# EAGLE design bluz_remote_v1 (EAGLE 7.3.0)
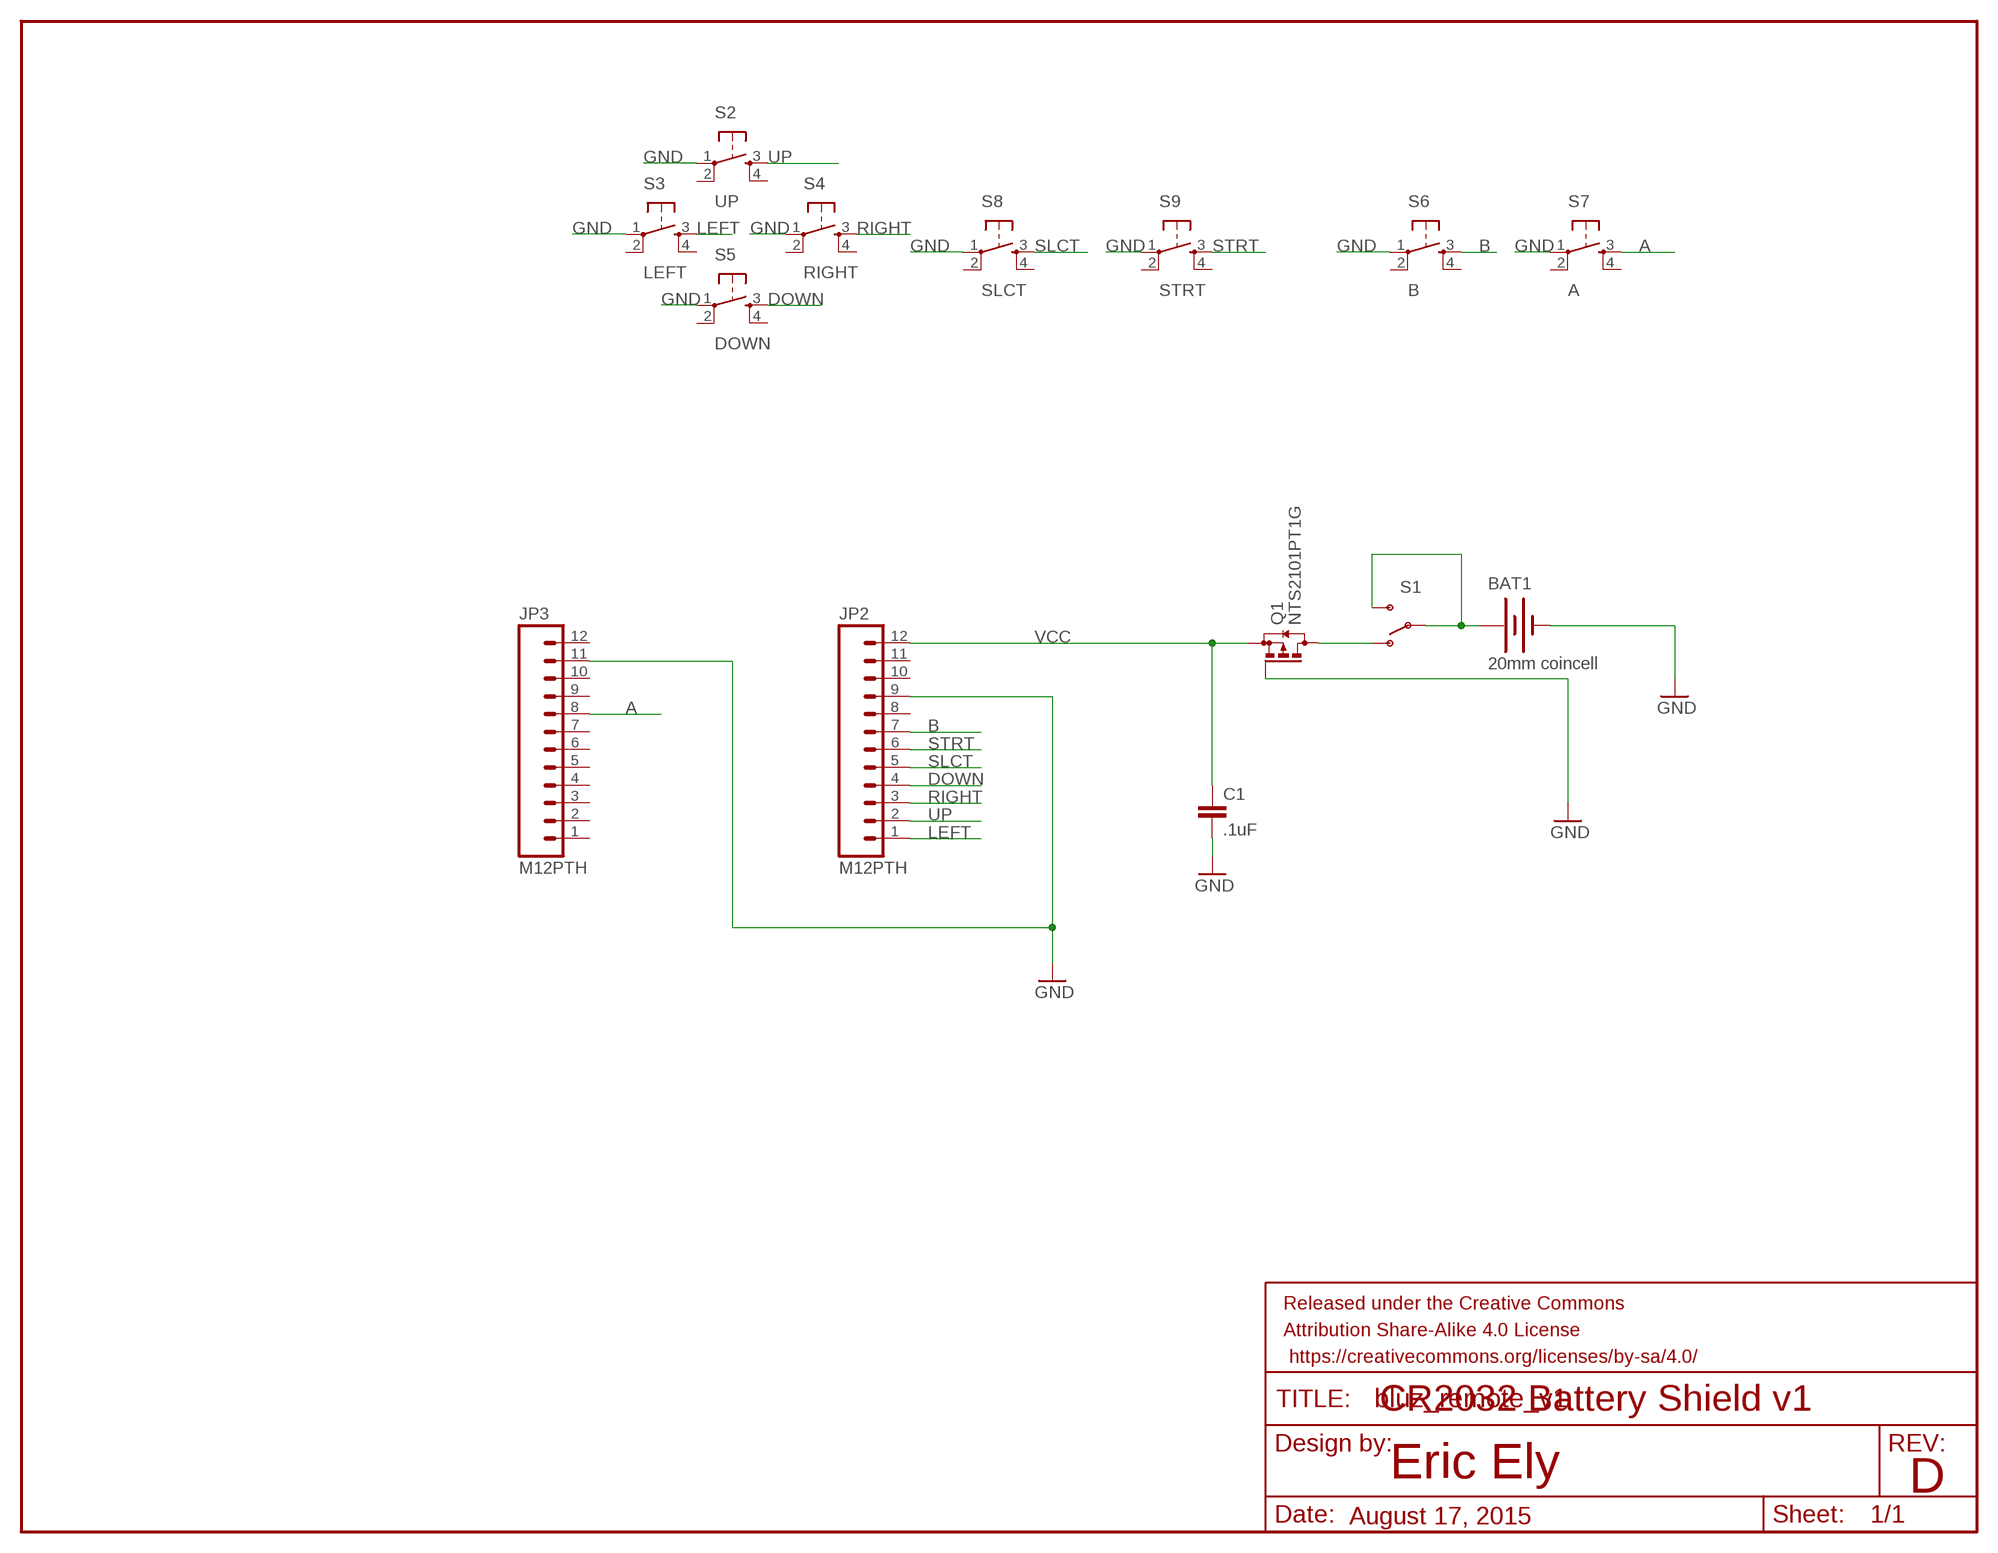
[diagram p0: schematic, sheet 1]

## Parts
BAT1  20mm coincell  BATTERY20MM_4LEGS  [BATTCON_20MM_4LEGS]
C1  .1uF  CAP0603-CAP  [0603-CAP]
FRAME1  FRAME-LETTER  [CREATIVE_COMMONS]
JP2  M12PTH  [1X12]
JP3  M12PTH  [1X12]
Q1  NTS2101PT1G  [SOT323]
S1  SWITCH-SPDTKIT  [SWITCH-SPDT_KIT]
S2  UP  TAC_SWITCHSMD  [TACTILE_SWITCH_SMD]
S3  LEFT  TAC_SWITCHSMD  [TACTILE_SWITCH_SMD]
S4  RIGHT  TAC_SWITCHSMD  [TACTILE_SWITCH_SMD]
S5  DOWN  TAC_SWITCHSMD  [TACTILE_SWITCH_SMD]
S6  B  TAC_SWITCHSMD  [TACTILE_SWITCH_SMD]
S7  A  TAC_SWITCHSMD  [TACTILE_SWITCH_SMD]
S8  SLCT  TAC_SWITCHSMD  [TACTILE_SWITCH_SMD]
S9  STRT  TAC_SWITCHSMD  [TACTILE_SWITCH_SMD]

## Nets
A: JP3.8 S7.3
B: JP2.7 S6.3
DOWN: JP2.4 S5.3
GND: BAT1.2(-) C1.2 JP2.9 JP3.11 Q1.1(G) S2.1 S3.1 S4.1 S5.1 S6.1 S7.1 S8.1 S9.1
LEFT: JP2.1 S3.3
N$1: BAT1.1(+) S1.2(P) S1.3(S)
N$5: Q1.3(D) S1.1(O)
RIGHT: JP2.3 S4.3
SLCT: JP2.5 S8.3
STRT: JP2.6 S9.3
UP: JP2.2 S2.3
VCC: C1.1 JP2.12 Q1.2(S)
Unconnected: JP2.8 JP2.10 JP2.11 JP3.1 JP3.2 JP3.3 JP3.4 JP3.5 JP3.6 JP3.7 JP3.9 JP3.10 JP3.12 S2.2 S2.4 S3.2 S3.4 S4.2 S4.4 S5.2 S5.4 S6.2 S6.4 S7.2 S7.4 S8.2 S8.4 S9.2 S9.4

## Notes on the sheet
- CR2032 Battery Shield v1
- Eric Ely
- D
- August 17, 2015

## Library data of the parts
BAT1 = SparkFun-Electromechanical:BATTERY: Battery Holders Various common sizes : AA, AAA, 20mm coin cell and 12mm coin cell. 20MM_4LEGS, BATT-10373; PROD_ID: BATT-10373
C1 = SparkFun-Capacitors:CAP: Capacitor Standard 0603 ceramic capacitor, and 0.1" leaded capacitor.
FRAME1 = SparkFun-Aesthetics:FRAME-LETTER: Schematic Frame Standard 8.5x11 US Letter frame
JP2 JP3 = SparkFun-Connectors:M12: Header 12 Standard 12-pin 0.1" header. Use with straight break away headers (SKU : PRT-00116), right angle break away headers (PRT-00553), swiss pins (PRT-00743), machine pins (PRT-00117), and female headers (PRT-00115).
Q1 = bluze_libr:NTS2101PT1G
S1 = SparkFun-Electromechanical:SWITCH-SPDT: SPDT Switch Simple slide switch, Spark Fun Electronics SKU : COM-00102 DPDT SMT slide switch, AYZ0202, SWCH-08179; PROD_ID: SWCH-08261
S2-S9 = SparkFun-Electromechanical:TAC_SWITCH: Momentary Switch Button commonly used for reset or general input. Spark Fun Electronics SKU : COM-00097 SMT- SWCH-08247; PROD_ID: SWCH-08247

## Board
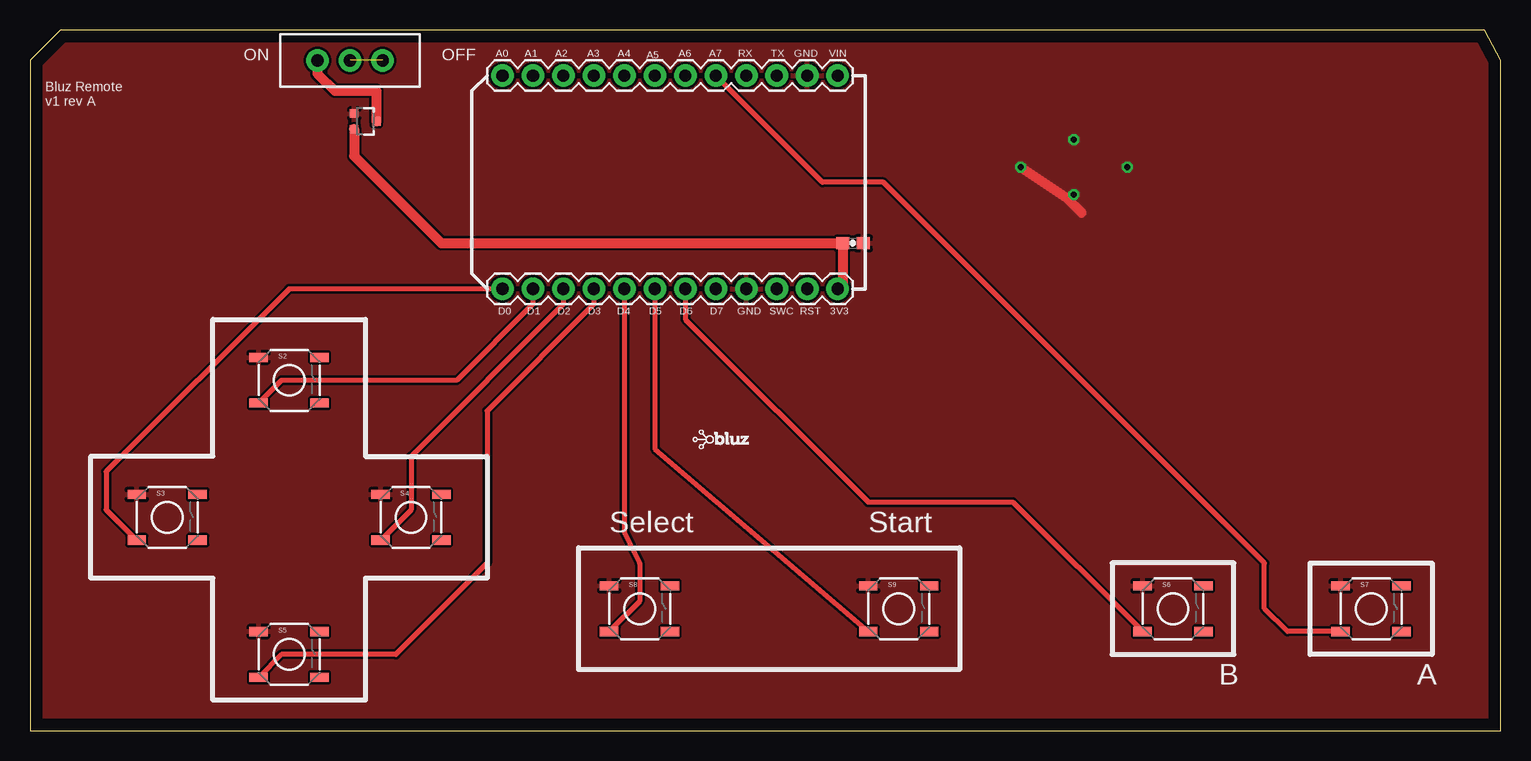
[diagram p1: board, top side]
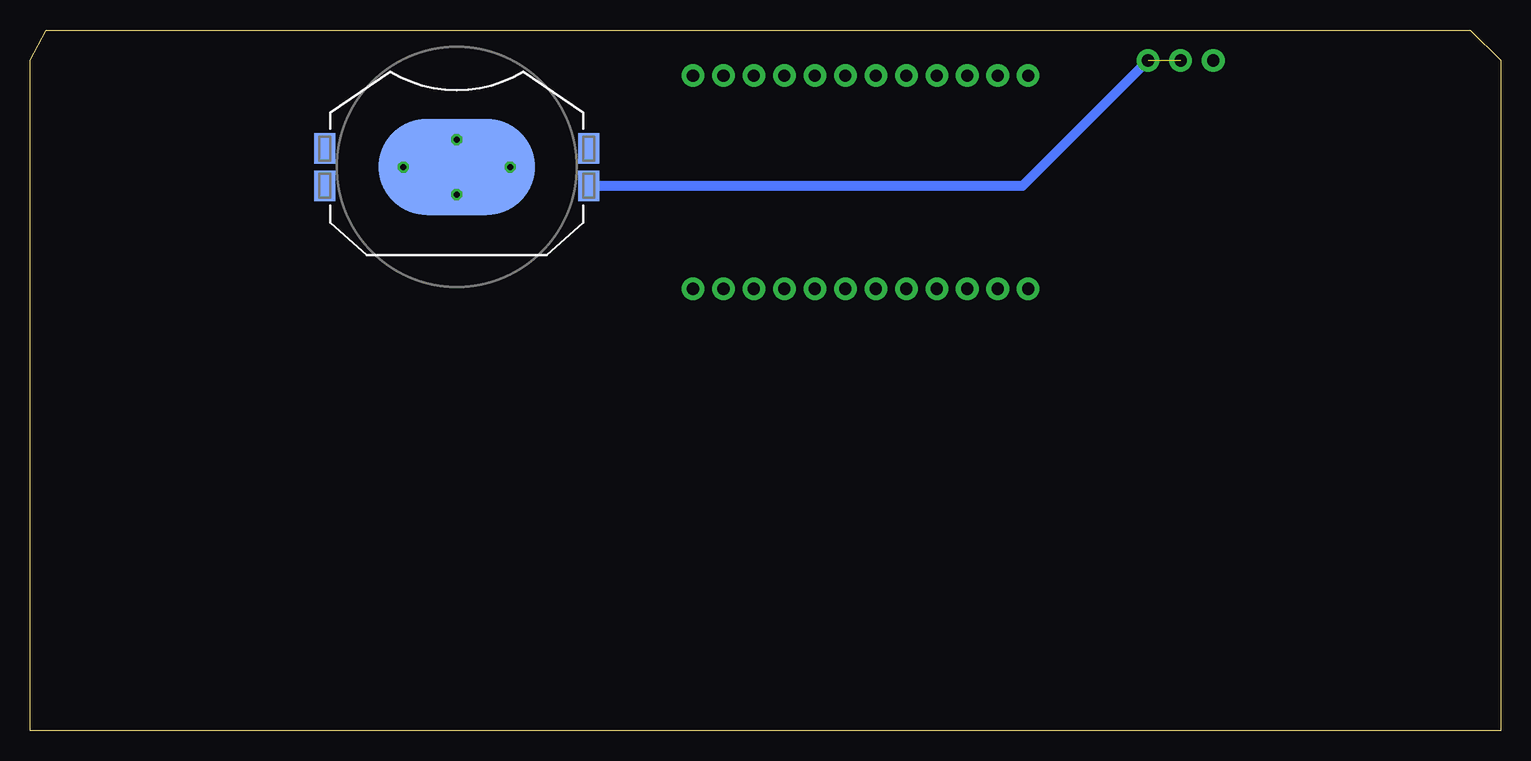
[diagram p2: board, bottom side, seen from below]

Size 122.56 x 58.42 mm. Coordinates in mm from the lower left corner, seen from the top.
Outline: 0,0 122.56,0 122.56,55.88 121.22,58.42 2.54,58.42 0,55.88 0,0
Copper layers (1*16): Top 0.035mm / dielectric 1.5mm / Bottom 0.035mm
Design rules "default *": minimum track width 10mil, minimum drill 24mil, track to track 8mil, track to pad 8mil, pad to pad 8mil, via to via 8mil, smd to smd 8mil, copper to edge 40mil, drill to drill 8mil, minimum pad ring 10mil, minimum via ring 8mil, stop-mask expansion 4mil, vias tented up to drill 31mil, thermal gap 10mil

### Footprints (pad centres in the part's own frame; a part is rotated, then mirrored left to right if it is on the bottom)
BATTCON_20MM_4LEGS = smd 1.778 x 2.54: 1 -11,1.55; 3 11,1.55; P$1 -11,-1.55; P$2 11,-1.55 | smd 13 x 8: 2 0,0
0603-CAP = smd 1.1 x 1: 1 -0.85,0; 2 0.85,0
1X12 = drill 1.016 pad 1.88: 1 0,0; 2 2.54,0; 3 5.08,0; 4 7.62,0; 5 10.16,0; 6 12.7,0; 7 15.24,0; 8 17.78,0; 9 20.32,0; 10 22.86,0; 11 25.4,0; 12 27.94,0
SOT323 = smd 0.7 x 0.7: 1 -0.65,-0.925; 2 0.65,-0.925; 3 0,0.925
SWITCH-SPDT_KIT = drill 1.016 pad 1.88: 1 0,2.718; 2 0,0; 3 0,-2.718
TACTILE_SWITCH_SMD = smd 1.524 x 0.762: 1 -2.54,1.905; 2 2.54,1.905; 3 -2.54,-1.905; 4 2.54,-1.905

### Placement (x,y rotation side)
BAT1  87,46.99 180 bottom
C1  68.58,40.64 0 top
FRAME1  21.59,-7.62 0 top  (outside the outline)
JP2  39.37,36.83 0 top
JP3  39.37,54.61 0 top
Q1  27.94,50.8 270 top
S1  26.67,55.88 90 top
S2  21.59,29.21 0 top
S3  11.43,17.78 0 top
S4  31.75,17.78 0 top
S5  21.59,6.35 0 top
S6  95.25,10.16 0 top
S7  111.76,10.16 0 top
S8  50.8,10.16 0 top
S9  72.39,10.16 0 top
U$1  [BLUZE_LOGO_LOW_RES]  55.24,23.5 0 top

### Tracks (layer width: path | path; a pad name or v marks a point on that pad's centre or on a via)
A
  Top 0.406: S7.3 104.78,8.26 102.87,10.16 102.87,13.97 71.12,45.72 66.04,45.72 JP3.8
B
  Top 0.406: JP2.7 54.61,34.29 69.85,19.05 81.92,19.05 S6.3
DOWN
  Top 0.406: JP2.4 46.99,35.56 38.1,26.67 38.1,13.97 30.48,6.35 20.95,6.35 S5.3
GND  (via drill 0.51)
  Top 0.813: v82.55,46.99 86.36,44.45 87.63,43.18
  Bottom 0.813: BAT1.2 v82.55,46.99
  other vias: 87,49.28 91.44,46.99 87,44.7
  pour Top: 0,0 121.92,0 121.92,58.42 0,58.42
LEFT
  Top 0.406: JP2.1 21.59,36.83 6.35,21.59 6.35,18.41 S3.3
N$1  (1 unrouted)
  Bottom 0.813: BAT1.1 39.83,45.44 S1.3
N$5
  Top 0.813: S1.1 23.95,54.79 25.4,53.34 28.86,53.34 Q1.3
RIGHT
  Top 0.406: JP2.3 44.45,35.56 31.75,22.86 31.75,18.41 S4.3
SLCT
  Top 0.406: JP2.5 49.53,16.51 50.8,13.97 50.8,10.79 S8.3
STRT
  Top 0.406: JP2.6 52.07,23.5 S9.3
UP
  Top 0.406: JP2.2 41.91,35.56 35.56,29.21 20.95,29.21 S2.3
VCC
  Top 0.813: Q1.2 27.02,47.91 34.29,40.64 C1.1 67.73,37.25 JP2.12

### Text on the board
tPlace: ON | OFF | Bluz Remote / v1 rev A | Select | Start | B | A
tNames: A0 | A1 | A2 | A3 | A4 | A5 | A6 | A7 | RX | TX | GND | VIN | D0 | D1 | D2 | D3 | D4 | D5 | D6 | D7 | GND | SWC | RST | 3V3